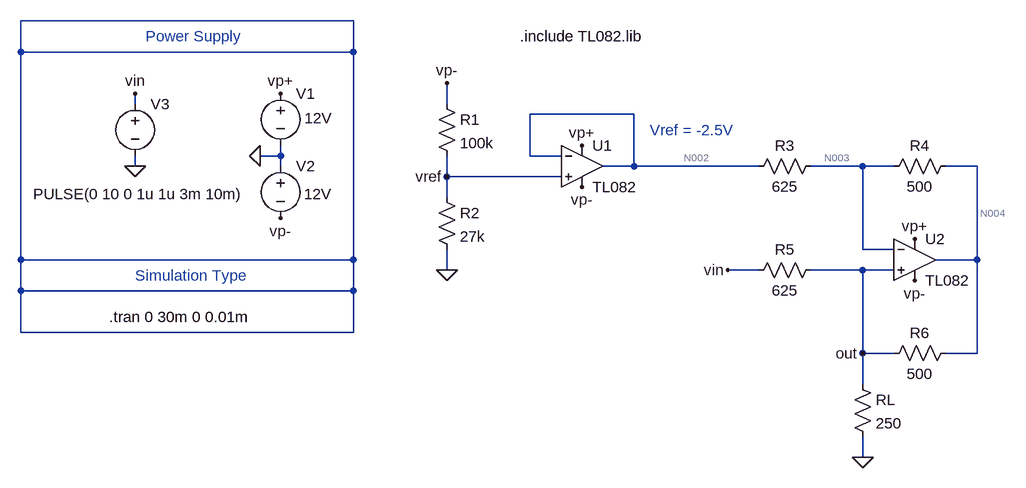
[diagram p0: schematic Simulacion.asc]
Simulacion.asc, the LTspice schematic file:
Version 4
SHEET 1 1304 680
WIRE 144 -64 -368 -64
WIRE -368 -16 -368 -64
WIRE 144 -16 144 -64
WIRE 144 -16 -368 -16
WIRE -192 64 -192 48
WIRE 288 64 288 32
WIRE 576 80 416 80
WIRE 32 144 32 128
WIRE 32 144 0 144
WIRE 416 144 416 80
WIRE 464 144 416 144
WIRE -192 160 -192 144
WIRE 32 160 32 144
WIRE 576 160 576 80
WIRE 576 160 528 160
WIRE 768 160 576 160
WIRE 928 160 848 160
WIRE 976 160 928 160
WIRE 1104 160 1056 160
WIRE 288 176 288 144
WIRE 464 176 288 176
WIRE 288 208 288 176
WIRE 928 288 928 160
WIRE 976 288 928 288
WIRE -368 304 -368 -16
WIRE 144 304 144 -16
WIRE 144 304 -368 304
WIRE 1104 304 1104 160
WIRE 1104 304 1040 304
WIRE 288 320 288 288
WIRE 768 320 720 320
WIRE 928 320 848 320
WIRE 976 320 928 320
WIRE -368 352 -368 304
WIRE 144 352 144 304
WIRE 144 352 -368 352
WIRE -368 416 -368 352
WIRE 144 416 144 352
WIRE 144 416 -368 416
WIRE 928 448 928 320
WIRE 976 448 928 448
WIRE 1104 448 1104 304
WIRE 1104 448 1056 448
WIRE 928 496 928 448
WIRE 928 608 928 576
FLAG 0 144 0
FLAG 32 48 vp+
FLAG 32 240 vp-
FLAG 288 320 0
FLAG 496 128 vp+
FLAG 496 192 vp-
FLAG 288 32 vp-
FLAG -192 160 0
FLAG 928 608 0
FLAG -192 48 vin
FLAG 1008 272 vp+
FLAG 1008 336 vp-
FLAG 288 176 vref
FLAG 928 448 out
FLAG 720 320 vin
SYMBOL voltage 32 32 R0
WINDOW 3 37 54 Left 2
SYMATTR Value 12V
SYMATTR InstName V1
SYMBOL voltage 32 144 R0
WINDOW 3 36 59 Left 2
SYMATTR Value 12V
SYMATTR InstName V2
SYMBOL res 272 48 R0
SYMATTR InstName R1
SYMATTR Value 100k
SYMBOL res 272 192 R0
SYMATTR InstName R2
SYMATTR Value 27k
SYMBOL OpAmps\\opamp2 496 96 R0
SYMATTR InstName U1
SYMATTR Value TL082
SYMBOL res 864 144 R90
WINDOW 0 0 56 VBottom 2
WINDOW 3 32 56 VTop 2
SYMATTR InstName R3
SYMATTR Value 625
SYMBOL OpAmps\\opamp2 1008 240 R0
SYMATTR InstName U2
SYMATTR Value TL082
SYMBOL res 1072 144 R90
WINDOW 0 0 56 VBottom 2
WINDOW 3 32 56 VTop 2
SYMATTR InstName R4
SYMATTR Value 500
SYMBOL res 864 304 R90
WINDOW 0 0 56 VBottom 2
WINDOW 3 32 56 VTop 2
SYMATTR InstName R5
SYMATTR Value 625
SYMBOL res 1072 432 R90
WINDOW 0 0 56 VBottom 2
WINDOW 3 32 56 VTop 2
SYMATTR InstName R6
SYMATTR Value 500
SYMBOL res 912 480 R0
SYMATTR InstName RL
SYMATTR Value 250
SYMBOL voltage -192 48 R0
WINDOW 123 0 0 Left 0
WINDOW 39 0 0 Left 0
WINDOW 3 -157 155 Left 2
SYMATTR Value PULSE(0 10 0 1u 1u 3m 10m)
SYMATTR InstName V3
TEXT 400 -40 Left 2 !.include TL082.lib
TEXT -232 392 Left 2 !.tran 0 30m 0 0.01m
TEXT 600 104 Left 2 ;Vref = -2.5V
TEXT -176 -40 Left 2 ;Power Supply
TEXT -192 328 Left 2 ;Simulation Type

The netlist it stands for:
* Simulacion.asc
V1 vp+ 0 12V
V2 0 vp- 12V
R1 vp- vref 100k
R2 vref 0 27k
XU1 vref N002 vp+ vp- N002 TL082  ; pins In+ In- V+ V- OUT
R3 N003 N002 625
XU2 out N003 vp+ vp- N004 TL082  ; pins In+ In- V+ V- OUT
R4 N004 N003 500
R5 out vin 625
R6 N004 out 500
RL out 0 250
V3 vin 0 PULSE(0 10 0 1u 1u 3m 10m)
.include TL082.lib
.tran 0 30m 0 0.01m
* Vref = -2.5V
* Power Supply
* Simulation Type
.backanno
.end

* Results of the author's LTspice run, read from the files saved beside the schematic
* Operating Point, zero values left out:
*   V(vp+) = 12 V
*   V(vp-) = -12 V
*   V(vref) = -2.551 V
*   V(n002) = -2.551 V
*   V(n003) = 1.02 V
*   V(n004) = 3.877 V
*   V(out) = 1.02 V
*   I(Rl) = 4.082 mA
*   I(R6) = 5.714 mA
*   I(R5) = 1.633 mA
*   I(R4) = 5.714 mA
*   I(R3) = 5.714 mA
*   I(R2) = -94.49 µA
*   I(R1) = -94.49 µA
*   I(V3) = 1.633 mA
*   I(V2) = -22.89 mA
*   I(V1) = -22.79 mA
*   Ix(u1:1) = 39.49 pA
*   Ix(u1:2) = 39.49 pA
*   Ix(u1:3) = 11.39 mA
*   Ix(u1:4) = -11.4 mA
*   Ix(u1:5) = 5.714 mA
*   Ix(u2:1) = 43.08 pA
*   Ix(u2:2) = 43.08 pA
*   Ix(u2:3) = 11.39 mA
*   Ix(u2:4) = -11.39 mA
*   Ix(u2:5) = -11.43 mA
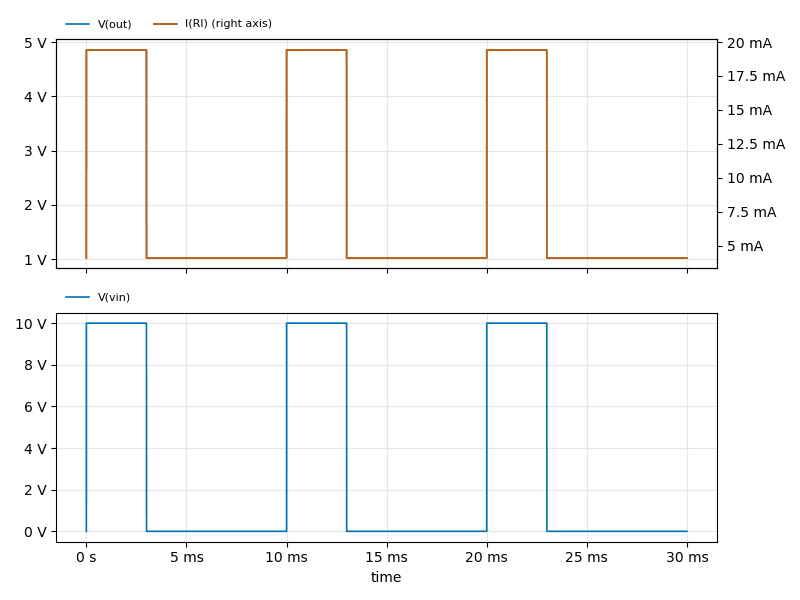
[diagram p1: Transient Analysis of Simulacion.asc, plotted from the saved traces]
* Transient Analysis, 1 run:
*   V(out): min 1.02 V, max 4.857 V, average 2.171 V, rms 2.792 V, last 1.02 V
*   I(Rl): min 4.079 mA, max 19.43 mA, average 8.683 mA, rms 11.17 mA, last 4.082 mA
*   V(vin): min 0 V, max 10 V, average 3.001 V, rms 5.478 V, last 0 V